# EAGLE design main (EAGLE 9.0.1)
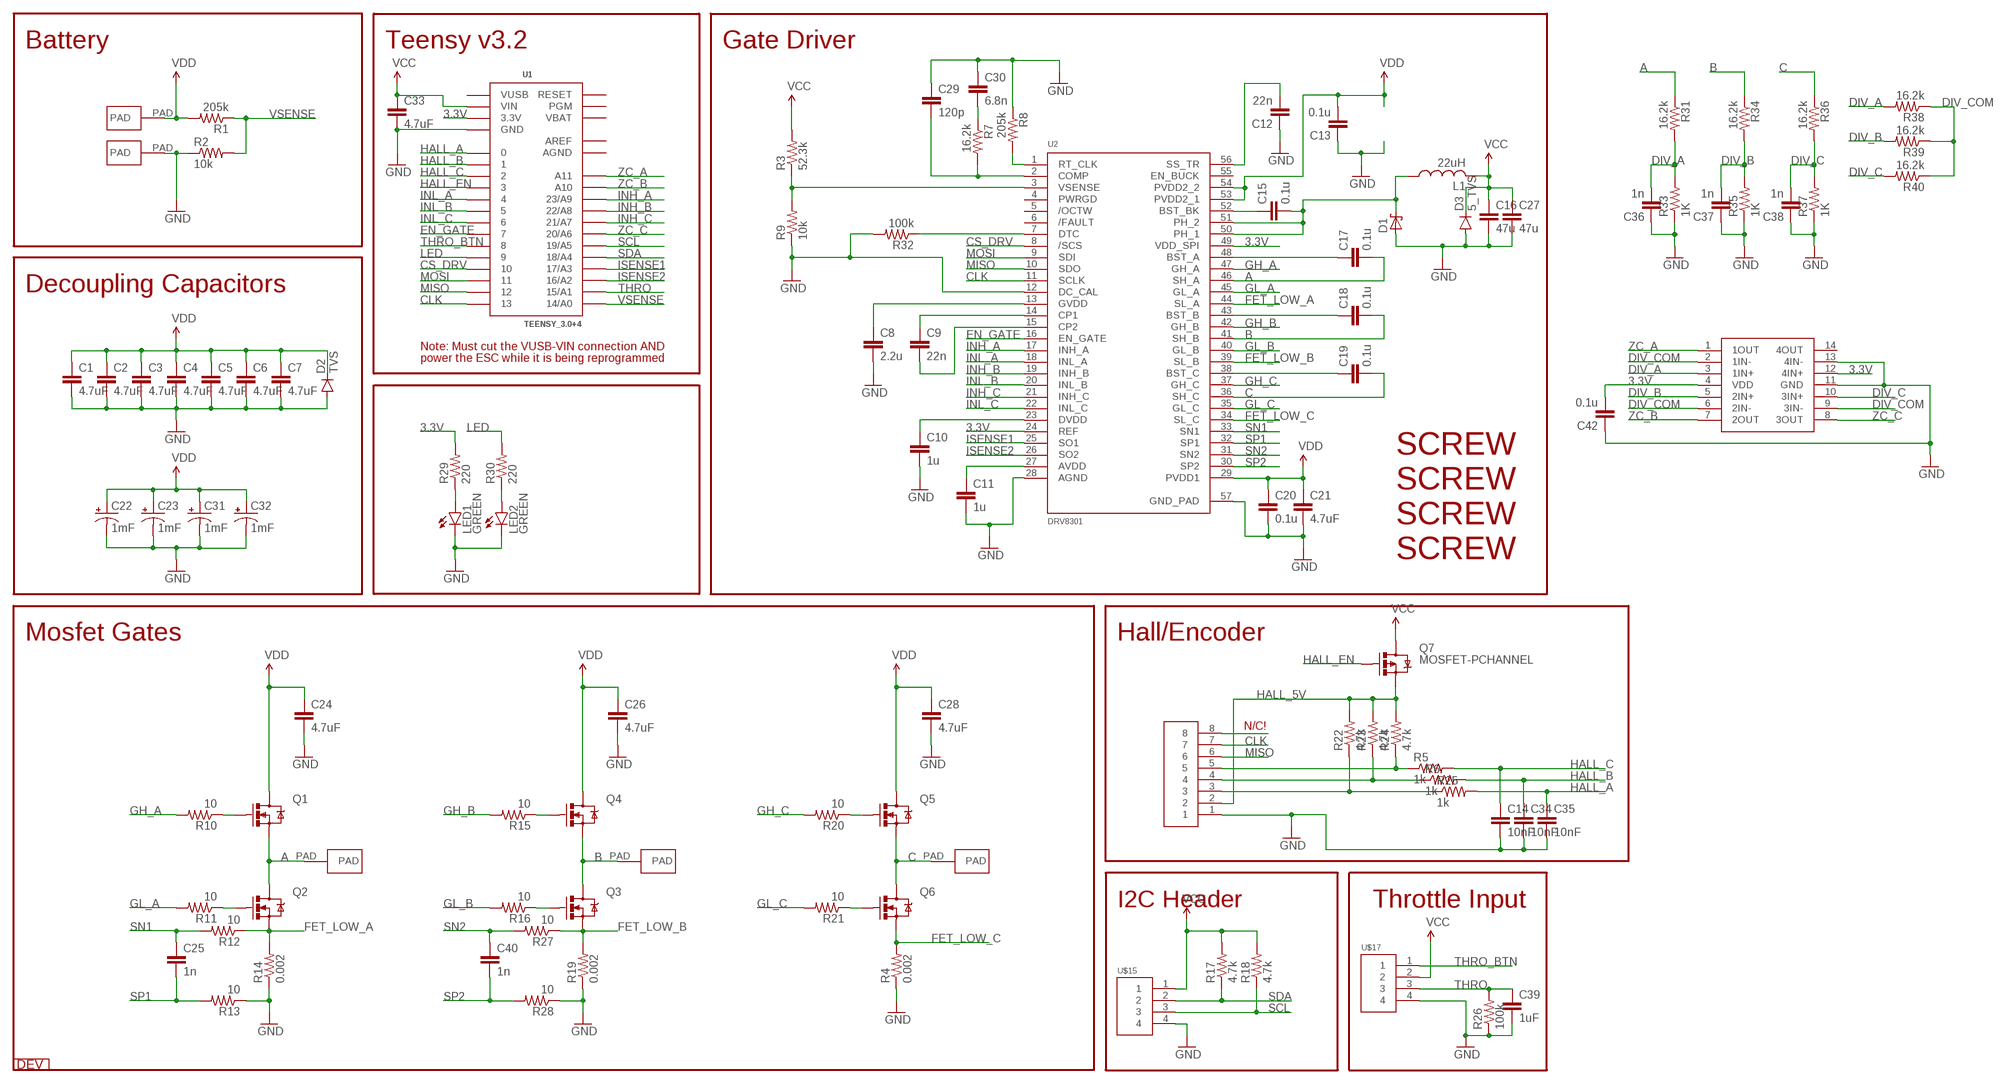
[diagram p0: schematic, sheet 1]

## Parts
C1  4.7uF  CAP1206  [1206]
C2  4.7uF  CAP1206  [1206]
C3  4.7uF  CAP1206  [1206]
C4  4.7uF  CAP1206  [1206]
C5  4.7uF  CAP1206  [1206]
C6  4.7uF  CAP1206  [1206]
C7  4.7uF  CAP1206  [1206]
C8  2.2u  CAP0603-CAP  [0603-CAP]
C9  22n  CAP0603-CAP  [0603-CAP]
C10  1u  CAP0603-CAP  [0603-CAP]
C11  1u  CAP0603-CAP  [0603-CAP]
C12  22n  CAP0603-CAP  [0603-CAP]
C13  0.1u  CAP0603-CAP  [0603-CAP]
C14  10nF  CAP0603-CAP  [0603-CAP]
C15  0.1u  CAP0603-CAP  [0603-CAP]
C16  47u  CAP0805  [0805]
C17  0.1u  CAP0603-CAP  [0603-CAP]
C18  0.1u  CAP0603-CAP  [0603-CAP]
C19  0.1u  CAP0603-CAP  [0603-CAP]
C20  0.1u  CAP0603-CAP  [0603-CAP]
C21  4.7uF  CAP1206  [1206]
C22  1mF  CAP_POLPTH4  [CPOL-RADIAL-1000UF-25V]
C23  1mF  CAP_POLPTH4  [CPOL-RADIAL-1000UF-25V]
C24  4.7uF  CAP1206  [1206]
C25  1n  CAP0603-CAP  [0603-CAP]
C26  4.7uF  CAP1206  [1206]
C27  47u  CAP0805  [0805]
C28  4.7uF  CAP1206  [1206]
C29  120p  CAP0603-CAP  [0603-CAP]
C30  6.8n  CAP0603-CAP  [0603-CAP]
C31  1mF  CAP_POLPTH4  [CPOL-RADIAL-1000UF-25V]
C32  1mF  CAP_POLPTH4  [CPOL-RADIAL-1000UF-25V]
C33  4.7uF  CAP1206  [1206]
C34  10nF  CAP0603-CAP  [0603-CAP]
C35  10nF  CAP0603-CAP  [0603-CAP]
C36  1n  CAP0603-CAP  [0603-CAP]
C37  1n  CAP0603-CAP  [0603-CAP]
C38  1n  CAP0603-CAP  [0603-CAP]
C39  1uF  CAP0603-CAP  [0603-CAP]
C40  1n  CAP0603-CAP  [0603-CAP]
C42  0.1u  CAP0603-CAP  [0603-CAP]
D1  SCHOTTKY_SMA  [SMA]
D2  TVS  DIODEES3J  [SMC]
D3  5_TVS  DIODESOT23  [SOT23-3]
L1  22uH  L-USL5650M  [L5650M]
LED1  GREEN  LED1206  [LED-1206]
LED2  GREEN  LED1206  [LED-1206]
Q1  MOSFET-NCHANNELDFN5X6  [DFN5X6]
Q2  MOSFET-NCHANNELDFN5X6  [DFN5X6]
Q3  MOSFET-NCHANNELDFN5X6  [DFN5X6]
Q4  MOSFET-NCHANNELDFN5X6  [DFN5X6]
Q5  MOSFET-NCHANNELDFN5X6  [DFN5X6]
Q6  MOSFET-NCHANNELDFN5X6  [DFN5X6]
Q7  MOSFET-PCHANNEL  [SOT23-3]
R1  205k  RESISTOR0603  [0603-RES]
R2  10k  RESISTOR0603  [0603-RES]
R3  52.3k  RESISTOR0603  [0603-RES]
R4  0.002  RESISTOR2512  [R2512]
R5  1k  RESISTOR0603-RES  [0603-RES]
R6  1k  RESISTOR0603-RES  [0603-RES]
R7  16.2k  RESISTOR0603  [0603-RES]
R8  205k  RESISTOR0603  [0603-RES]
R9  10k  RESISTOR0603  [0603-RES]
R10  10  RESISTOR0603  [0603-RES]
R11  10  RESISTOR0603  [0603-RES]
R12  10  RESISTOR0603  [0603-RES]
R13  10  RESISTOR0603  [0603-RES]
R14  0.002  RESISTOR2512  [R2512]
R15  10  RESISTOR0603  [0603-RES]
R16  10  RESISTOR0603  [0603-RES]
R17  4.7k  RESISTOR0603-RES  [0603-RES]
R18  4.7k  RESISTOR0603-RES  [0603-RES]
R19  0.002  RESISTOR2512  [R2512]
R20  10  RESISTOR0603  [0603-RES]
R21  10  RESISTOR0603  [0603-RES]
R22  4.7k  RESISTOR0603  [0603-RES]
R23  4.7k  RESISTOR0603  [0603-RES]
R24  4.7k  RESISTOR0603  [0603-RES]
R25  1k  RESISTOR0603-RES  [0603-RES]
R26  100k  RESISTOR0603-RES  [0603-RES]
R27  10  RESISTOR0603  [0603-RES]
R28  10  RESISTOR0603  [0603-RES]
R29  220  RESISTOR0603  [0603-RES]
R30  220  RESISTOR0603  [0603-RES]
R31  16.2k  RESISTOR0603  [0603-RES]
R32  100k  RESISTOR0603  [0603-RES]
R33  1K  RESISTOR0603  [0603-RES]
R34  16.2k  RESISTOR0603  [0603-RES]
R35  1K  RESISTOR0603  [0603-RES]
R36  16.2k  RESISTOR0603  [0603-RES]
R37  1K  RESISTOR0603  [0603-RES]
R38  16.2k  RESISTOR0603  [0603-RES]
R39  16.2k  RESISTOR0603  [0603-RES]
R40  16.2k  RESISTOR0603  [0603-RES]
U1  TEENSY_3.0+4  [TEENSY_3.0+4]
U2  DRV8301  [DRV8301]
U$2  HEADER8  [8PINVALULOK]
U$12  OPAMP_QUAD  [TSSOP-14]
U$15  HEADER4VALULOK  [4PINVALULOK]
U$16  DEV  [DEV]
U$17  HEADER4VALULOK  [4PINVALULOK]
U$19  SCREW  [M3HOLE]
U$20  SCREW  [M3HOLE]
U$21  SCREW  [M3HOLE]
U$22  SCREW  [M3HOLE]
U$23  PAD  [PAD]
U$24  PAD  [PAD]
U$25  PAD  [PAD]
U$26  PAD  [PAD]
U$27  PAD  [PAD]

## Nets
3.3V: C42.2 R29.2 U1.3.3V U1.3.3V1(3.3V) U2.24(REF) U2.49(VDD_SPI) U$12.4(VDD) U$12.12(4IN+)
A: C17.2 Q1.1(S) Q1.2(S) Q1.3(S) Q2.PAD(D) R31.1 U2.46(SH_A) U$23.PAD
B: C18.2 Q3.PAD(D) Q4.1(S) Q4.2(S) Q4.3(S) R34.1 U2.41(SH_B) U$24.PAD
C: C19.2 Q5.1(S) Q5.2(S) Q5.3(S) Q6.PAD(D) R36.1 U2.36(SH_C) U$25.PAD
CLK: U1.13 U2.11(SCLK) U$2.7
CS_DRV: U1.10 U2.8(/SCS)
DIV_A: C36.2 R31.2 R33.2 R38.2 U$12.3(1IN+)
DIV_B: C37.2 R34.2 R35.2 R39.2 U$12.5(2IN+)
DIV_C: C38.2 R36.2 R37.2 R40.2 U$12.10(3IN+)
DIV_COM: R38.1 R39.1 R40.1 U$12.2(1IN-) U$12.6(2IN-) U$12.9(3IN-)
EN_GATE: U1.7 U2.16(EN_GATE)
FET_LOW_A: Q2.1(S) Q2.2(S) Q2.3(S) R12.1 R14.2 U2.44(SL_A)
FET_LOW_B: Q3.1(S) Q3.2(S) Q3.3(S) R19.2 R27.1 U2.39(SL_B)
FET_LOW_C: Q6.1(S) Q6.2(S) Q6.3(S) R4.2 U2.34(SL_C)
GH_A: R10.2 U2.47(GH_A)
GH_B: R15.2 U2.42(GH_B)
GH_C: R20.2 U2.37(GH_C)
GL_A: R11.2 U2.45(GL_A)
GL_A': Q2.4(G) R11.1
GL_B: R16.2 U2.40(GL_B)
GL_B': Q3.4(G) R16.1
GL_C: R21.2 U2.35(GL_C)
GL_C': Q6.4(G) R21.1
GND: C1.2 C2.2 C3.2 C4.2 C5.2 C6.2 C7.2 C8.2 C10.2 C11.2 C12.1 C13.1 C14.2 C16.2 C20.2 C21.2 C22.- C23.- C24.2 C26.2 C27.2 C28.2 C29.1 C30.1 C31.- C32.- C33.2 C34.2 C35.2 C36.1 C37.1 C38.1 C39.2 C42.1 D1.A D2.A D3.1(A) LED1.C LED2.C R2.1 R4.1 R8.1 R9.1 R13.1 R14.1 R19.1 R26.1 R28.1 R32.2 R33.1 R35.1 R37.1 U1.GND U1.GND1(GND) U2.12(DC_CAL) U2.28(AGND) U2.57(GND_PAD) U$2.1 U$12.11(GND) U$12.13(4IN-) U$15.4 U$17.4 U$27.PAD
HALL_5V: Q7.2(S) R22.2 R23.2 R24.2 U$2.2
HALL_A: C35.1 R25.2 U1.0
HALL_B: C34.1 R6.2 U1.1
HALL_C: C14.1 R5.2 U1.2
HALL_EN: Q7.1(G) U1.3
INH_A: U1.23/A9 U2.17(INH_A)
INH_B: U1.22/A8 U2.19(INH_B)
INH_C: U1.21/A7 U2.21(INH_C)
INL_A: U1.4 U2.18(INL_A)
INL_B: U1.5 U2.20(INL_B)
INL_C: U1.6 U2.22(INL_C)
ISENSE1: U1.17/A3 U2.25(SO1)
ISENSE2: U1.16/A2 U2.26(SO2)
LED: R30.2 U1.9
MISO: U1.12 U2.10(SDO) U$2.6
MOSI: U1.11 U2.9(SDI)
N$1: Q4.4(G) R15.1
N$2: R3.1 R9.2 U2.3(VSENSE)
N$3: C29.2 R7.2 U2.2(COMP)
N$4: C10.1 U2.23(DVDD)
N$5: Q5.4(G) R20.1
N$6: C12.2 U2.56(SS_TR)
N$7: C30.2 R7.1
N$8: C15.1 U2.52(BST_BK)
N$9: Q1.4(G) R10.1
N$10: R8.2 U2.1(RT_CLK)
N$11: LED1.A R29.1
N$12: R32.1 U2.7(DTC)
N$13: R5.1 R24.1 U$2.5
N$14: R6.1 R23.1 U$2.4
N$15: R22.1 R25.1 U$2.3
N$16: LED2.A R30.1
N$17: U$2.8
N$28: C19.1 U2.38(BST_C)
N$30: C9.1 U2.14(CP1)
N$31: C11.1 U2.27(AVDD)
N$32: C9.2 U2.15(CP2)
N$33: C8.1 U2.13(GVDD)
N$34: C18.1 U2.43(BST_B)
N$44: C17.1 U2.48(BST_A)
N$47: C15.2 D1.C L1.1 U2.50(PH_1) U2.51(PH_2)
SCL: R18.1 U1.19/A5 U$15.3
SDA: R17.1 U1.18/A4 U$15.2
SN1: C25.1 R12.2 U2.33(SN1)
SN2: C40.1 R27.2 U2.31(SN2)
SP1: C25.2 R13.2 U2.32(SP1)
SP2: C40.2 R28.2 U2.30(SP2)
THRO: C39.1 R26.2 U1.15/A1 U$17.3
THRO_BTN: U1.8 U$17.1
VCC: C16.1 C27.1 C33.1 D3.3(C) L1.2 Q7.3(D) R3.2 R17.2 R18.2 U1.VIN U$15.1 U$17.2
VDD: C1.1 C2.1 C3.1 C4.1 C5.1 C6.1 C7.1 C13.2 C20.1 C21.1 C22.+ C23.+ C24.1 C26.1 C28.1 C31.+ C32.+ D2.C Q1.PAD(D) Q4.PAD(D) Q5.PAD(D) R1.2 U2.29(PVDD1) U2.53(PVDD2_1) U2.54(PVDD2_2) U$26.PAD
VSENSE: R1.1 R2.2 U1.14/A0
ZC_A: U1.A11 U$12.1(1OUT)
ZC_B: U1.A10 U$12.7(2OUT)
ZC_C: U1.20/A6 U$12.8(3OUT)
Unconnected: U1.PGM U1.RESET U2.4(PWRGD) U2.5(/OCTW) U2.6(/FAULT) U2.55(EN_BUCK) U$12.14(4OUT)

## Notes on the sheet
- Battery | Teensy v3.2 | Gate Driver
- Decoupling Capacitors
- Note: Must cut the VUSB-VIN connection AND
- power the ESC while it is being reprogrammed
- Mosfet Gates | Hall/Encoder
- N/C!
- I2C Header | Throttle Input

## Power pins joined to a net without a drawn wire
AGND: U1.AGND
AREF: U1.AREF
VBAT: U1.VBAT
VUSB: U1.VUSB

## Library data of the parts
C1-C13 C15-C21 C24-C30 C33 C36-C38 C40 C42 = SparkFun-Capacitors:CAP: Capacitor Standard 0603 ceramic capacitor, and 0.1" leaded capacitor.
C14 C34 C35 C39 = SparkFun-Passives:CAP: Capacitor Standard 0603 ceramic capacitor, and 0.1" leaded capacitor.
C22 C23 C31 C32 = SparkFun-Capacitors:CAP_POL: Capacitor Polarized These are standard SMD and PTH capacitors. Normally 10uF, 47uF, and 100uF in electrolytic and tantalum varieties. Always verify the external diameter of the through hole cap, it varies with capacity, voltage, and manufacturer. The EIA devices should be standard.
D1 = sc_usercreated:SCHOTTKY_SMA
D2 = SparkFun-DiscreteSemi:DIODE: Diode These are standard reverse protection diodes and small signal diodes. SMA package can handle up to about 1A. SOD-323 can handle about 200mA. What the SOD-323 package when ordering, there are some mfgs out there that are 5-pin packages.; PROD_ID: DIO-12441; VALUE: 3A/600V
D3 = SparkFun-DiscreteSemi:DIODE: Diode These are standard reverse protection diodes and small signal diodes. SMA package can handle up to about 1A. SOD-323 can handle about 200mA. What the SOD-323 package when ordering, there are some mfgs out there that are 5-pin packages.
L1 = rcl:L-US: INDUCTOR, American symbol
LED1 LED2 = SparkFun-LED:LED: LEDs Standard schematic elements and footprints for 5mm, 3mm, 1206, and 0603 sized LEDs. 5mm - Spark Fun Electronics SKU : COM-00529 (and others)
Q1-Q6 = 2018:MOSFET-NCHANNEL: Generic NMOS footprint
Q7 = SparkFun-DiscreteSemi:MOSFET-PCHANNEL: Generic PMOSFET IRLML2244 - TRANS-11153 (SOT-23 -20V -4.3A) (1.Gate 2.Source 3.Drain) FQP27P06 - COM-10349 <http://www.sparkfun.com/products/10349> (TO-220 -60V -27A) (1.Gate 2.Source 3.Drain); PROD_ID: TRANS-08285
R1-R4 R7-R16 R19-R24 R27-R40 = SparkFun-Resistors:RESISTOR: Resistor Basic schematic elements and footprints for 0603, 1206, and PTH resistors.
R5 R6 R17 R18 R25 R26 = SparkFun-Passives:RESISTOR: Resistor Basic schematic elements and footprints for 0603, 1206, and PTH resistors.
U1 = Teensy3.0:TEENSY_3.0+4: Teensy 3.0 board, showing all pins that are easily acessible. See 'AllAnalogPins" and 'AllPins' packages for additional pin holes, as needed. The 'Basic' package has fewer pins.
U2 = F-J:DRV8301
U$2 = Custom_old:HEADER8
U$12 = 2018:OPAMP_QUAD
U$15 U$17 = Custom_old:HEADER4
U$16 = F-J:DEV
U$19-U$22 = Custom_old:SCREW
U$23-U$27 = Custom_old:PAD

## Board
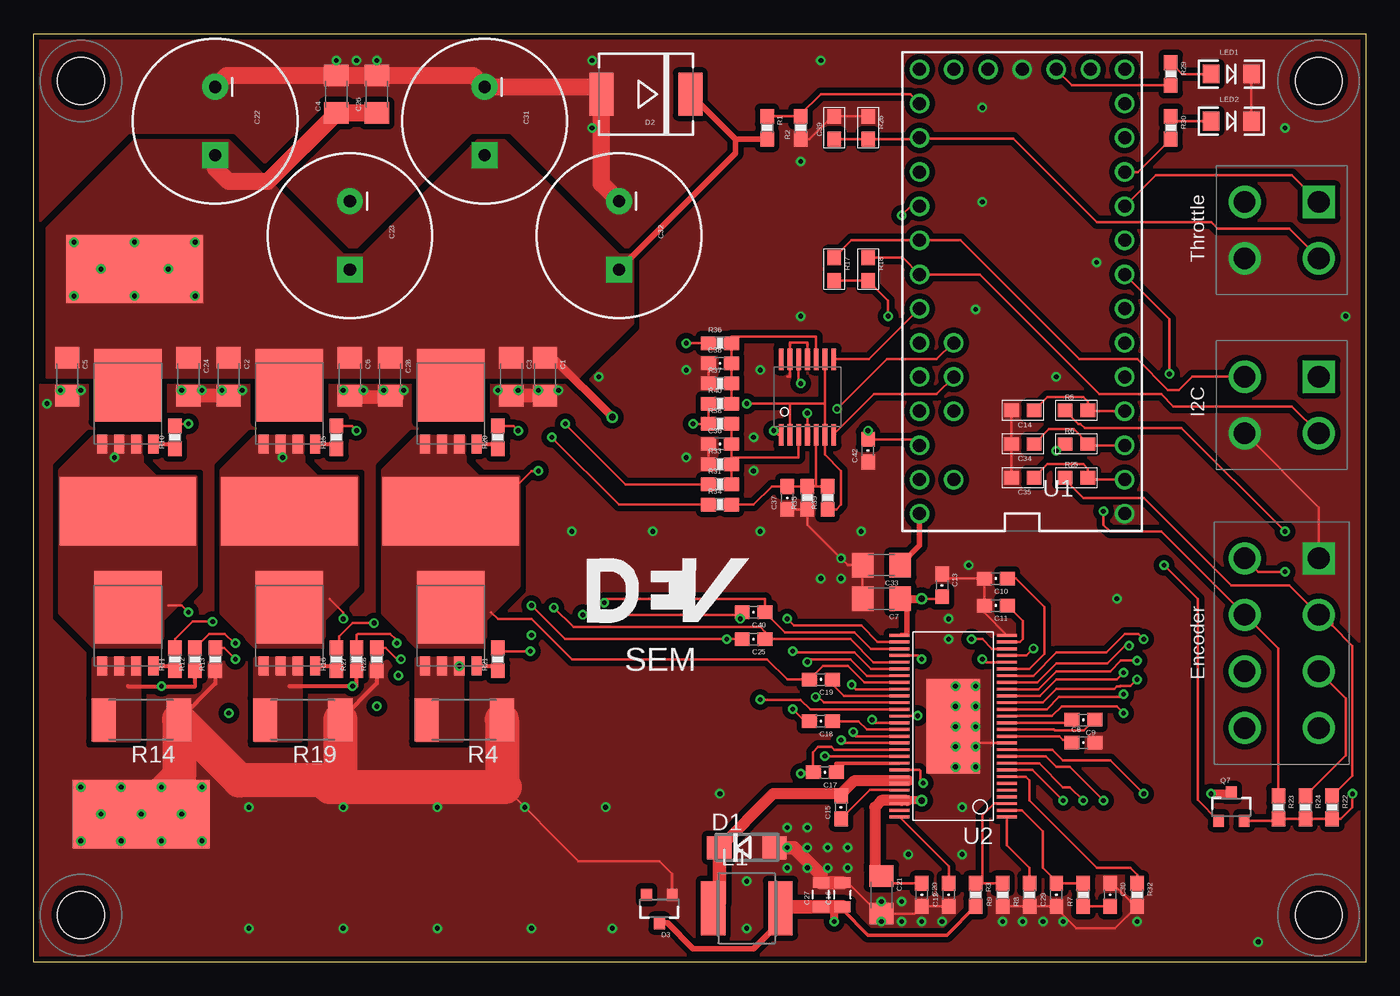
[diagram p1: board, top side]
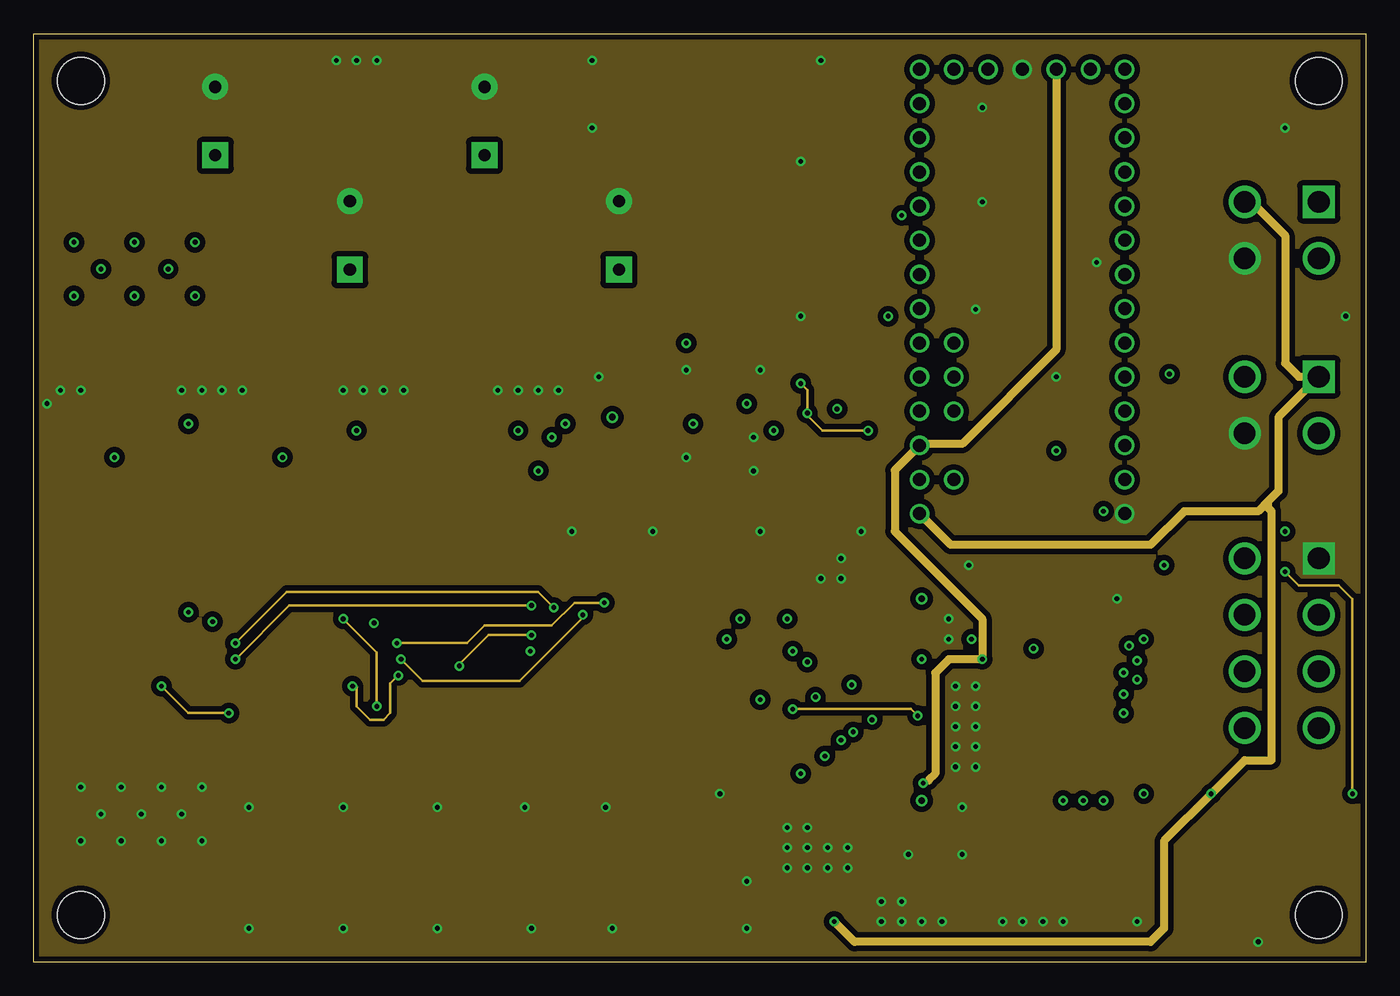
[diagram p2: board, inner layer Route2]
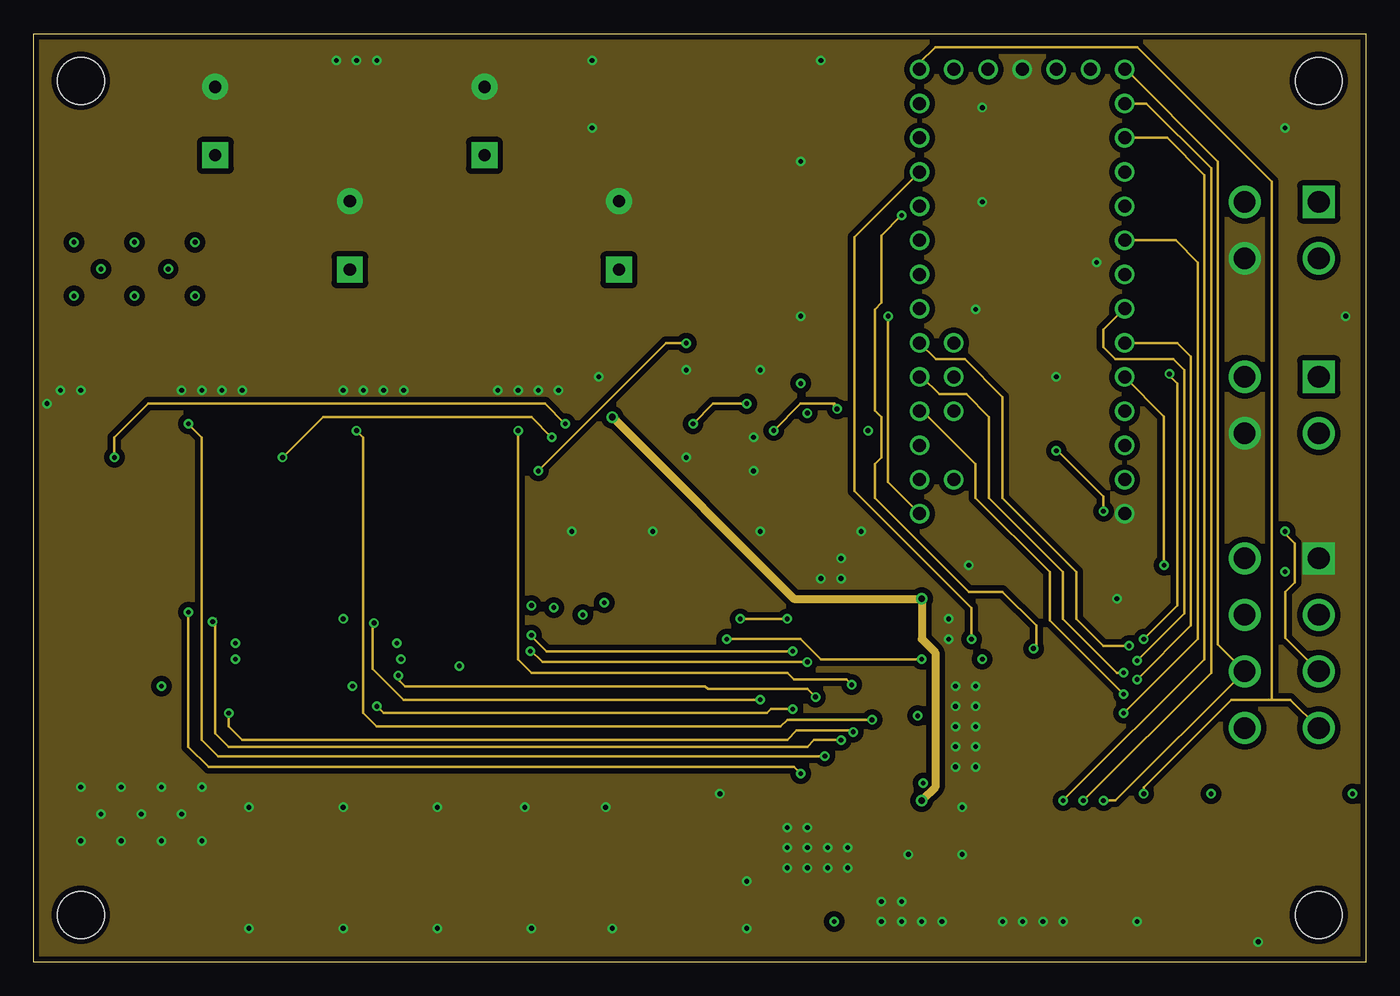
[diagram p3: board, inner layer Route15]
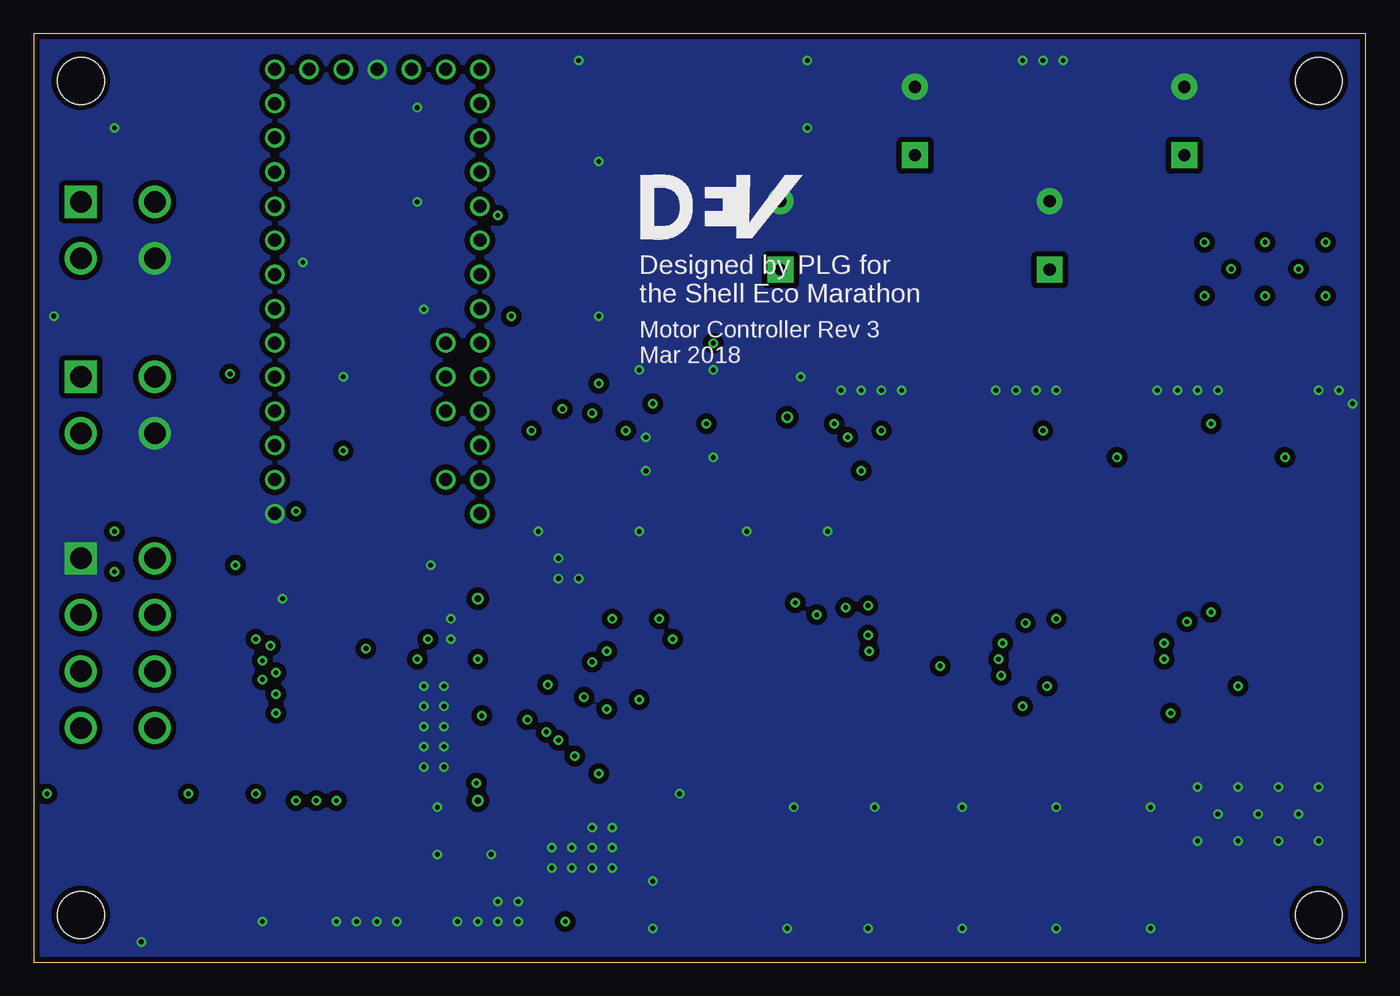
[diagram p4: board, bottom side, seen from below]

Size 99 x 69 mm. Coordinates in mm from the lower left corner, seen from the top.
Outline: 0,0 0,69 99,69 99,0 0,0
Copper layers (1*2+15*16): Top 0.0356mm / dielectric 1.5011mm / Route2 0.0356mm / dielectric 0.1499mm / Route15 0.0356mm / dielectric 0.2007mm / Bottom 0.0356mm
Design rules "patrick *": minimum track width 6mil, minimum drill 13mil, track to track 6mil, track to pad 6mil, pad to pad 6mil, via to via 6mil, smd to smd 6mil, copper to edge 15mil, drill to drill 6mil, minimum pad ring 7mil, minimum via ring 7mil, stop-mask expansion 3mil, vias tented up to drill 30mil, thermal gap 10mil

### Footprints (pad centres in the part's own frame; a part is rotated, then mirrored left to right if it is on the bottom)
1206 = smd 1.6 x 1.8: 1 -1.4,0; 2 1.4,0
0603-CAP = smd 1.1 x 1: 1 -0.85,0; 2 0.85,0
0805 = smd 0.8 x 1.2: 1 -0.9,0; 2 0.9,0
CPOL-RADIAL-1000UF-25V = drill 0.9 pad 1.93 square: + 2.54,0 | drill 0.9 pad 1.93: - -2.54,0
SMA = smd 1.8 x 1.7: A 2.05,0; C -2.05,0
SMC = smd 1.778 x 3.175: A 3.302,0; C -3.302,0
SOT23-3 = smd 0.8 x 0.9: 1 -0.95,-1; 2 0.95,-1; 3 0,1.1
L5650M = smd 1.8 x 4: 1 -2.5,0; 2 2.5,0
LED-1206 = smd 1.2 x 1.4: A -1.5,0; C 1.5,0
DFN5X6 = smd 0.75 x 1.4: 1 -1.905,-3; 2 -0.635,-3; 3 0.635,-3; 4 1.905,-3 | smd 5 x 5.4: PAD 0,1.37
0603-RES = smd 1.1 x 1: 1 -0.85,0; 2 0.85,0
R2512 = smd 1.8 x 3.2: 1 -2.8,0; 2 2.8,0
TEENSY_3.0+4 = drill 0.965: 0 -7.62,13.97; 1 -7.62,11.43; 2 -7.62,8.89; 3 -7.62,6.35; 3.3V 7.62,11.43; 3.3V1 -2.54,-16.51; 4 -7.62,3.81; 5 -7.62,1.27; 6 -7.62,-1.27; 7 -7.62,-3.81; 8 -7.62,-6.35; 9 -7.62,-8.89; 10 -7.62,-11.43; 11 -7.62,-13.97; 12 -7.62,-16.51; 13 7.62,-16.51; 14/A0 7.62,-13.97; 15/A1 7.62,-11.43; 16/A2 7.62,-8.89; 17/A3 7.62,-6.35; 18/A4 7.62,-3.81; 19/A5 7.62,-1.27; 20/A6 7.62,1.27; 21/A7 7.62,3.81; 22/A8 7.62,6.35; 23/A9 7.62,8.89; A10 5.08,6.35; A11 5.08,3.81; AGND 7.62,13.97; AREF 5.08,8.89; GND -7.62,16.51; GND1 0,-16.51; PGM 2.54,-16.51; RESET 5.08,-16.51; VBAT -5.08,-16.51; VIN 7.62,16.51; VUSB 5.08,13.97
DRV8301 = smd 1.5 x 0.21: 1 -4,6.75; 2 -4,6.25; 3 -4,5.75; 4 -4,5.25; 5 -4,4.75; 6 -4,4.25; 7 -4,3.75; 8 -4,3.25; 9 -4,2.75; 10 -4,2.25; 11 -4,1.75; 12 -4,1.25; 13 -4,0.75; 14 -4,0.25; 15 -4,-0.25; 16 -4,-0.75; 17 -4,-1.25; 18 -4,-1.75; 19 -4,-2.25; 20 -4,-2.75; 21 -4,-3.25; 22 -4,-3.75; 23 -4,-4.25; 24 -4,-4.75; 25 -4,-5.25; 26 -4,-5.75; 27 -4,-6.25; 28 -4,-6.75; 29 4,-6.75; 30 4,-6.25; 31 4,-5.75; 32 4,-5.25; 33 4,-4.75; 34 4,-4.25; 35 4,-3.75; 36 4,-3.25; 37 4,-2.75; 38 4,-2.25; 39 4,-1.75; 40 4,-1.25; 41 4,-0.75; 42 4,-0.25; 43 4,0.25; 44 4,0.75; 45 4,1.25; 46 4,1.75; 47 4,2.25; 48 4,2.75; 49 4,3.25; 50 4,3.75; 51 4,4.25; 52 4,4.75; 53 4,5.25; 54 4,5.75; 55 4,6.25; 56 4,6.75 | smd 4 x 7: 57 0,0
8PINVALULOK = drill 1.6 square: 1 0,5.5 | drill 1.6: 2 0,0; 3 4.2,5.5; 4 4.2,0; 5 8.4,5.5; 6 8.4,0; 7 12.6,5.5; 8 12.6,0
TSSOP-14 = smd 1.6 x 0.35: 1 -2.8,1.95; 2 -2.8,1.3; 3 -2.8,0.65; 4 -2.8,0; 5 -2.8,-0.65; 6 -2.8,-1.3; 7 -2.8,-1.95; 8 2.8,-1.95; 9 2.8,-1.3; 10 2.8,-0.65; 11 2.8,0; 12 2.8,0.65; 13 2.8,1.3; 14 2.8,1.95
4PINVALULOK = drill 1.6 square: 1 0,5.5 | drill 1.6: 2 0,0; 3 4.2,5.5; 4 4.2,0
M3HOLE = hole 3.5: 0,0
PAD = smd 10.16 x 5.08: PAD 0,0

### Placement (x,y rotation side)
C1  38,43.5 270 top
C2  14.5,43.5 270 top
C3  35.5,43.5 270 top
C4  22.5,64.5 90 top
C5  2.5,43.5 270 top
C6  23.5,43.5 270 top
C7  63,27 180 top
C8  78,16.3 0 top
C9  78,18 180 top
C10  71.5,28.5 180 top
C11  71.5,26.5 180 top
C12  68,5 90 top
C13  67.5,28 270 top
C14  73.5,41 180 top
C15  60,11.5 90 top
C16  60.1,5 90 top
C17  58.8,14.1 180 top
C18  58.5,17.9 180 top
C19  58.5,21 180 top
C20  66,5 270 top
C21  63,5 270 top
C22  13.5,62.5 270 top
C23  23.5,54 270 top
C24  11.5,43.5 270 top
C25  53.5,24 180 top
C26  25.5,64.5 90 top
C27  58.5,5 90 top
C28  26.5,43.5 270 top
C29  76,5 90 top
C30  80,5 270 top
C31  33.5,62.5 270 top
C32  43.5,54 270 top
C33  63,29.5 180 top
C34  73.5,38.5 180 top
C35  73.5,36 180 top
C36  51,38.5 0 top
C37  56,34.5 90 top
C38  51,44.5 0 top
C39  59.5,62 90 top
C40  53.5,26 180 top
C42  62,38 90 top
D1  53,8.5 0 top
D2  45.5,64.5 180 top
D3  46.5,4 180 top
L1  53,4 0 top
LED1  89,66 0 top
LED2  89,62.5 0 top
Q1  7,41.5 0 top
Q2  7,25 0 top
Q3  19,25 0 top
Q4  19,41.5 0 top
Q5  31,41.5 0 top
Q6  31,25 0 top
Q7  89,11.5 0 top
R1  54.5,62 270 top
R2  57,62 90 top
R3  70,5 270 top
R4  32,18 180 top
R5  77.5,41 0 top
R6  77.5,38.5 0 top
R7  78,5 90 top
R8  74,5 90 top
R9  72,5 90 top
R10  10.5,39 90 top
R11  10.5,22.5 90 top
R12  12,22.5 90 top
R13  13.5,22.5 90 top
R14  8,18 180 top
R15  22.5,39 90 top
R16  22.5,22.5 90 top
R17  59.5,51.5 270 top
R18  62,51.5 270 top
R19  20,18 180 top
R20  34.5,39 90 top
R21  34.5,22.5 90 top
R22  96.5,11.5 270 top
R23  92.5,11.5 270 top
R24  94.5,11.5 270 top
R25  77.5,36 0 top
R26  62,62 270 top
R27  24,22.5 90 top
R28  25.5,22.5 90 top
R29  84.5,66 270 top
R30  84.5,62 270 top
R31  51,35.5 0 top
R32  82,5 270 top
R33  51,37 0 top
R34  51,34 0 top
R35  57.5,34.5 90 top
R36  51,46 0 top
R37  51,43 0 top
R38  51,40 0 top
R39  59,34.5 90 top
R40  51,41.5 0 top
U1  73.46,49.83 180 top
U2  68.33,17.53 180 top
U$2  90,30 270 top
U$12  57.5,42 90 top
U$15  90,43.5 270 top
U$16  41.15,25.24 0 top
U$17  90,56.5 270 top
U$19  3.5,3.5 0 top
U$20  95.5,3.5 0 top
U$21  3.5,65.5 0 top
U$22  95.5,65.5 0 top
U$23  7,33.5 0 top
U$24  19,33.5 180 top
U$25  31,33.5 180 top
U$26  7.5,51.5 0 top
U$27  8,11 0 top
U$28  DEV  [DEV]  53.85,53.74 0 bottom

### Tracks (layer width: path | path; a pad name or v marks a point on that pad's centre or on a via)
3.3V  (via drill 0.35)
  Top 0.203: R29.2 77.15,65.15 76,66.3 U1.3.3V1 | U1.3.3V 65.39,38.85 C42.2 v62,39.5 | U$12.4 v57.5,40.8 | v57,43 56.85,43.15 U$12.12 | v66.1,13.3 65.9,13.5 65.9,14.2 65.82,14.28 U2.49 | U2.24 70.82,22.28 70.7,22.4 70.6,22.4 v70.5,22.5
  Route2 0.203: v62,39.5 58.6,39.5 57.5,40.6 v57.5,40.8 57.5,42.5 v57,43 | 66.5,13.5 66.3,13.3 v66.1,13.3
  Route2 0.61: 66.5,13.5 67,14 67,21.5 68,22.5 v70.5,22.5 70.5,25.5 64,32 64,36.56 U1.3.3V 65.94,38.5 69,38.5 76,45.5 U1.3.3V1
A  (via drill 0.35)
  Top 0.203: U2.46 59.52,15.78 59.3,16 58.3,16 57.9,15.6 57.9,14.15 C17.2 57.1,14.1 v57,14 | v11.5,26 11,26.5 10,26.5 | R31.1 44,35.5 v39.5,40
  Route15 0.203: v57,14 56.5,14.5 13,14.5 11.5,16 v11.5,26 | v39.5,40 38,41.5 8.5,41.5 6,39 v6,37.5
  pour Top (isolate 0.406, no thermals): 4.5,39 2,36.5 2,31 2,26 4.5,23.5 9.5,23.5 9.5,25.5 12,28 12,36 9,36 8,37 8,39
B  (via drill 0.35)
  Top 0.203: U2.41 65.58,18.28 65.6,18.3 v65.7,18.3 | v56.4,18.8 57.3,17.9 C18.2 | v23,25.5 23,26 22,27 | R34.1 43.5,34 v38.5,39
  Route2 0.203: v65.7,18.3 65.2,18.8 v56.4,18.8 | v25.5,19 25.5,23 v23,25.5
  Route15 0.203: v56.4,18.8 54.8,18.8 54.5,18.5 26,18.5 v25.5,19 | v38.5,39 37,40.5 21.5,40.5 v18.5,37.5
  pour Top (isolate 0.406, no thermals): 16.5,39 14,36.5 14,31 14,26 16.5,23.5 21.5,23.5 21.5,25.5 24,28 24,36 21,36 20,37 20,39
C  (via drill 0.35)
  Top 0.203: U2.36 61.72,20.78 60.5,22 58.65,22 C19.2 56,21 54.5,22.5 40,22.5 37,25.5 34.5,25.5 34,26 | R36.1 v48.5,46 | v37.5,36.5 37,36.5 36,35.5
  Route15 0.203: v48.5,46 47,46 v37.5,36.5
  pour Top (isolate 0.406, no thermals): 28.5,39 26,36.5 26,31 26,26 28.5,23.5 33.5,23.5 33.5,25.5 36,28 36,36 33,36 32,37 32,39
CLK  (via drill 0.35)
  Top 0.203: U2.11 75.72,15.78 76.5,15 80,15 v82.5,12.5
  Route15 0.203: v82.5,12.5 82.5,13 89,19.5 92,19.5 | 92,19.5 93.4,19.5 U$2.7 | U1.13 65.84,66.84 67,68 82,68 92,58 92,19.5
CS_DRV  (via drill 0.35)
  Top 0.203: U2.8 74.22,14.28 v76.5,12
  Route15 0.203: v76.5,12 87,22.5 87,58.5 84.24,61.26 U1.10
DIV_A
  Top 0.203: R38.2 C36.2 51.85,37.5 | 51.85,37.5 R33.2 R31.2 | U$12.3 56.85,37.5 51.85,37.5
DIV_B
  Top 0.203: R34.2 53.5,34 54.85,35.35 C37.2 R35.2 58,35.35 | 58,35.35 R39.2 | U$12.5 58.15,35.5 58,35.35
DIV_C
  Top 0.203: R40.2 R37.2 C38.2 R36.2 51.85,46.5 58.15,46.5 U$12.10
DIV_COM  (via drill 0.35)
  Top 0.203: R40.1 R38.1 v49,40 | R39.1 59.65,33.65 60,34 60,36.5 58.8,37.7 U$12.6 58.8,41.5 | 56,41.5 v53,41.5 | 58.5,41.5 56,41.5 | 58.5,41.5 58.8,41.5 | U$12.2 56.2,41.5 56,41.5 | U$12.9 58.8,41.5 | 58.8,41.5 58.5,41.5
  Route15 0.203: v49,40 50.5,41.5 v53,41.5
EN_GATE  (via drill 0.35)
  Top 0.203: U2.16 75.68,18.28 76.4,19 80.5,19 v81,18.5
  Route15 0.203: v81,18.5 86.5,24 86.5,52 84.86,53.64 U1.7
FET_LOW_A  (via drill 0.35)
  Top 0.203: U2.44 61.12,16.78 60.9,17 v60.9,17.1
  Top 0.254: 12,20.5 12,20.8
  Top 0.305: 12,20.8 R12.1 | 7,20.5 v9.5,20.5 12,20.5
  Route2 0.203: v14.5,18.5 11.5,18.5 v9.5,20.5
  Route15 0.203: v60.9,17.1 60.8,17.2 56.7,17.2 56,16.5 15.5,16.5 14.5,17.5 v14.5,18.5
  pour Top (isolate 0.406, no thermals): 4.5,22.5 4.5,16.5 7.8,16.5 7.8,22.5
FET_LOW_B  (via drill 0.35)
  Top 0.203: U2.39 58.72,19.28 58.3,19.7 v58.1,19.7
  Top 0.305: R27.1 24,20.5 v23.7,20.5 19,20.5
  Route2 0.203: v27.1,21.3 26.5,20.7 26.5,18.5 26,18 25,18 24,19 24,20.5 v23.7,20.5
  Route15 0.203: v58.1,19.7 57.5,20.3 50.1,20.3 49.9,20.5 27.6,20.5 27.2,20.9 27.2,21.2 v27.1,21.3
  pour Top (isolate 0.406, no thermals): 16.5,22.5 16.5,16.5 19.8,16.5 19.8,22.5
FET_LOW_C  (via drill 0.35)
  Top 0.203: U2.34 62.22,21.78 61,23 56.5,23 v56.4,23.1
  Route2 0.203: v37,24.3 33.8,24.3 31.5,22 Q6.3
  Route15 0.203: v56.4,23.1 38.1,23.1 37,24.2 v37,24.3
  other vias: 31.64,22
  pour Top (isolate 0.406, no thermals): 28.5,22.5 28.5,16.5 31.8,16.5 31.8,22.5
GH_A  (via drill 0.35)
  Top 0.203: v11.5,40 10.65,40 R10.2 | U2.47 58.82,15.28 v58.8,15.3
  Route15 0.203: v11.5,40 12.5,39 12.5,16.5 13.7,15.3 v58.8,15.3
GH_B  (via drill 0.35)
  Top 0.203: U2.42 62.52,17.78 v62.3,18 | v24,39.5 23.65,39.85 R15.2
  Route15 0.203: v62.3,18 56,18 55.5,17.5 25.5,17.5 24.5,18.5 24.5,39 v24,39.5
GH_C  (via drill 0.35)
  Top 0.203: U2.37 61.12,20.28 v60.8,20.6 | v36,39.5 35.65,39.85 R20.2
  Route15 0.203: v60.8,20.6 60.4,21 56.5,21 56,21.5 37,21.5 36,22.5 v36,39.5
GL_A  (via drill 0.35)
  Top 0.203: U2.45 60.12,16.28 60,16.4 v60,16.5 | v13.3,25.3 11.8,25.3 10.5,24 R11.2
  Route15 0.203: v60,16.5 57.99,16.5 57.5,16 14.5,16 13.5,17 13.5,25.5 v13.3,25.3
GL_A'
  Top 0.305: Q2.4 10.5,22 R11.1
GL_B  (via drill 0.35)
  Top 0.203: U2.40 57.72,18.78 57,19.5 v54,19.5 | v25.3,25.2 23.7,25.2 22.7,24.2 22.7,23.55 R16.2
  Route15 0.203: v54,19.5 27.5,19.5 25.2,21.8 25.2,25.1 v25.3,25.2
GL_B'
  Top 0.305: Q3.4 22.5,22 R16.1
GL_C  (via drill 0.35)
  Top 0.203: U2.35 61.92,21.28 60.7,22.5 57.6,22.5 57.4,22.3 v57.5,22.3 | v36.9,23.1 34.75,23.1 R21.2
  Route15 0.203: v57.5,22.3 37.8,22.3 36.9,23.2 v36.9,23.1
GL_C'
  Top 0.305: Q6.4 34.5,22 R21.1
GND  (via drill 0.35)
  Top 0.203: C38.1 R37.1 | R33.1 C36.1 | C37.1 R35.1 | R35.1 57.5,33.6 | R35.1 57.5,32.5 v60,30 60.5,29.5 C33.2 C7.2 | R9.1 R8.1 C29.1 76,4 77.5,2.5 80.35,2.5 R32.2 81.65,4.5 81.5,4.5 80.15,5.85 C30.1 | U2.57 69.56,16.3 71.3,16.3 71.32,16.28 U2.12 | 34.8,13.2 40.5,7.5 46.5,7.5 47.45,6.55 D3.1 | C16.2 60.5,5.9 62.8,3.6 C21.2 65.45,3.6 C20.2 C12.1 68,4 | LED1.C LED2.C | C14.2 C34.2 C35.2 | U$15.4 95.5,33.8 U$2.1 | R26.1 C39.2 59.15,62.5 59,62.5 57.65,61.15 R2.1 | U2.28 70.65,25.96 C11.2 C10.2 67.85,28.5 C13.1 | U$12.11 57.5,46.04 56.2,46.04 U$12.13 56.2,43.5 56,43.5
  Top 0.305: R28.1 25.5,20.7 R19.1 | R13.1 13.5,20.7 R14.1
  Top 1.016: C24.2 C2.2 | C6.2 23.6,42 26.6,42 | 27,42 26.6,42 | 26.6,42 C28.2 | C3.2 C1.2 | C16.2 C27.2 58.5,6.5 56.5,8.5 v56,8.5 D1.A
  Top 1.27: C22.- 14.36,65.9 C4.2 C26.2 32.64,65.9 C31.- 41.66,65.04 D2.A 42.2,57.84 C32.-
  Top 2.54: U$27.PAD 10.8,13.8 R14.1 15.3,13.5 21.5,13.5 | 21.5,13.5 23,13.5 22.8,13.7 R19.1 | R4.1 34.8,13.2 35,13 22,13 21.5,13.5
  other vias: 54,44 53.5,39 53.5,36.5 1,41.5 2,42.5 3.5,42.5 11,42.5 12.5,42.5 14,42.5 15.5,42.5 23,42.5 24.5,42.5 26,42.5 27.5,42.5 34.5,42.5 36,42.5 37.5,42.5 39,42.5 64.5,3 63,3 66,3 67.5,3 72,3 73.5,3 75,3 76.5,3 53,2.5 53,6 56,10 57.5,10 59,8.5 60.5,8.5 60.5,7 59,7 57.5,8.5 56,7 57.5,7 68,25.5 68,24 68.5,20.5 70,20.5 70,19 68.5,19 70,17.5 68.5,17.5 68.5,16 70,16 70,14.5 68.5,14.5 69,11.5 69,8 65,8 64.5,4.5 63,4.5 8,11 3.5,13 3.5,9 5,11 6.5,13 6.5,9 9.5,9 11,11 9.5,13 12.5,13 12.5,9 16,11.5 23,11.5 30,11.5 42.5,11.5 36.5,11.5 51,12.5 43,2.5 37,2.5 30,2.5 23,2.5 16,2.5 40,32 46,32 54,32 61.5,32 69.5,29.5 80.5,27 76,43.5 70,48.5 70.5,56.5 70.5,63.5 41.5,67 58.5,67 41.5,62 57,59.5 57,48 48.5,37.5 48.5,44 42,43.5 22.5,67 24,67 25.5,67 93,62 82,3 58.5,28.5 60,28.5 91,1.5 79,52 97.5,48
  pour Bottom (isolate 0.406, no thermals): 0,69 99,69 99,0 0,0
  pour Top (isolate 0.406, rank 6, no thermals): -0.5,69.5 99.5,69.5 99.5,-0.5 -0.5,-0.5
  pour Route2 (isolate 0.406, no thermals): -1.5,70.5 100,70.5 100,-1 -1.5,-1
  pour Route15 (isolate 0.406, no thermals): -0.5,69.5 99.5,69.5 99.5,-0.5 -0.5,-0.5
HALL_5V  (via drill 0.35)
  Top 0.203: U$2.2 91,29 v93,29 | v98,12.5 98,11.5 97.15,10.65 R22.2 R24.2 R23.2 92.35,10.5 Q7.2
  Route2 0.203: v93,29 94,28 97,28 98,27 v98,12.5
HALL_A
  Top 0.203: U1.0 78.49,35.86 R25.2 78.35,36.65 78,37 75.35,37 C35.1
HALL_B
  Top 0.203: U1.1 78.45,38.4 R6.2 78.35,38.55 77.3,39.6 75.45,39.6 C34.1
HALL_C
  Top 0.203: U1.2 78.41,40.94 R5.2 78.35,41.65 78,42 75.35,42 C14.1
HALL_EN  (via drill 0.35)
  Top 0.203: Q7.1 86.5,12.05 86.5,27 v84,29.5
  Route15 0.203: v84,29.5 84,40.56 U1.3
INH_A  (via drill 0.35)
  Top 0.203: U2.17 75.28,18.78 76.2,19.7 80.7,19.7 80.9,19.9 v81,19.9
  Route15 0.203: v81,19.9 75.5,25.4 75.5,29 70,34.5 70,37 66.06,40.94 U1.23/A9
INH_B  (via drill 0.35)
  Top 0.203: U2.19 74.78,19.78 76,21 80.5,21 v81,21.5
  Route15 0.203: v81,21.5 80.5,21.5 76.5,25.5 76.5,29 71,34.5 71,40.5 69.3,42.2 67.3,42.2 66.02,43.48 U1.22/A8
INH_C  (via drill 0.35)
  Top 0.203: U2.21 74.58,20.78 76,22.2 79.8,22.2 81.1,23.5 v81.4,23.5 | v81.4,23.5 81.7,23.5 v81.4,23.5
  Route15 0.203: v81.4,23.5 79.5,23.5 77.5,25.5 77.5,29 72,34.5 72,42 69.2,44.8 67.06,44.8 U1.21/A7
INL_A  (via drill 0.35)
  Top 0.203: U2.18 74.98,19.28 76,20.3 80.3,20.3 80.5,20.5 80.74,20.5 80.75,20.51 81.51,20.51 v82,21
  Route15 0.203: v82,21 86,25 86,45 84.98,46.02 U1.4
INL_B  (via drill 0.35)
  Top 0.203: U2.20 74.68,20.28 76,21.6 80,21.6 80.8,22.4 v82,22.4
  Route15 0.203: v82,22.4 85.5,25.9 85.5,44 84.7,44.8 80.4,44.8 79.5,45.7 79.5,47 81.06,48.56 U1.5
INL_C  (via drill 0.35)
  Top 0.203: U2.22 74.28,21.28 76,23 79.7,23 81.1,24.4 82.1,24.4 v82.5,24 | v84.4,43.7 84.4,47.78 U1.6
  Route15 0.203: v82.5,24 85,26.5 85,43 84.4,43.6 v84.4,43.7
ISENSE1  (via drill 0.35)
  Top 0.203: U1.17/A3 65.18,56.18 v64.5,55.5 | v74.3,23.3 73.78,22.78 U2.25
  Route15 0.203: v64.5,55.5 63,54 63,49 62.5,48.5 62.5,41 63,40.5 63,37.5 62.5,37 62.5,34.5 69.5,27.5 72,27.5 74.5,25 74.5,23.5 v74.3,23.3
ISENSE2  (via drill 0.35)
  Top 0.203: U2.26 71.22,23.28 70.5,24 v69.69,24
  Route15 0.203: v69.69,24 69.69,26.31 61,35 61,53.88 U1.16/A2
LED
  Top 0.203: U1.9 82.07,58.72 R30.2
MISO  (via drill 0.35)
  Top 0.203: U2.10 75.22,15.28 76,14.5 77,14.5 v79.5,12
  Route15 0.203: v79.5,12 80.4,12 U$2.6 88,23.6 88,59.5 81.16,66.34 U1.12
MOSI  (via drill 0.35)
  Top 0.203: U2.9 74.72,14.78 76.5,13 77,13 v78,12
  Route15 0.203: v78,12 87.5,21.5 87.5,59 82.7,63.8 U1.11
N$1
  Top 0.305: Q4.4 22.15,38.5 R15.1
N$2
  Top 0.203: 70.5,5.85 R3.1 | 70.5,5.85 R9.2 | U2.3 71.38,11.78 70.5,10.9 70.5,5.85
N$3
  Top 0.203: U2.2 73.42,11.28 75,9.7 75,7 76,6 C29.2 R7.2
N$4
  Top 0.203: U2.23 73.98,21.78 75.1,22.9 75.1,26.4 73,28.5 C10.1
N$5
  Top 0.305: Q5.4 34.15,38.5 R20.1
N$6
  Top 0.203: U2.56 68,7.11 C12.2
N$7
  Top 0.203: R7.1 C30.2
N$8
  Top 0.203: C15.1 62.13,12.78 U2.52
N$9
  Top 0.305: Q1.4 10.15,38.5 R10.1
N$10
  Top 0.203: U2.1 72.33,8.67 74,7 R8.2
N$11
  Top 0.203: R29.1 85.35,66 LED1.A
N$12
  Top 0.203: U2.7 73.72,13.78 74,13.5 74,12 79,7 81.5,7 82,6.5 R32.1
N$13  (via drill 0.35)
  Top 0.203: R24.1 97.5,15.35 97.5,19.6 U$2.5 | v93,32 85.3,39.7 78.1,39.7 77.8,40 77.65,40 R5.1
  Route15 0.203: U$2.5 93,24.1 93,27.5 93.7,28.2 93.7,31.1 93,31.8 v93,32
N$14  (via drill 0.35)
  Top 0.203: R23.1 92.5,23.3 U$2.4 83.8,32 80,32 79.5,32.5 v79.5,33.5 | v76,38 76.15,38 R6.1
  Route15 0.203: v79.5,33.5 79.5,34.6 76,38.1 v76,38
N$15
  Top 0.203: R25.1 76.65,35.85 78,34.5 82.5,34.5 89,28 93.3,28 U$2.3 96.2,25.8 96.5,25.5 96.5,25 98,23.5 98,13.85 R22.1
N$16
  Top 0.203: R30.1 84.85,62.5 LED2.A
N$28
  Top 0.203: U2.38 60.22,19.78 59.35,20.65 C19.1
N$30
  Top 0.203: U2.14 75.82,17.28 75.9,17.2 78.05,17.2 C9.1
N$31
  Top 0.203: C11.1 73.5,25.35 73.5,24 73.28,23.78 U2.27
N$32
  Top 0.203: U2.15 76.93,17.78 C9.2
N$33
  Top 0.203: U2.13 76.22,16.78 76.5,16.5 76.95,16.5 C8.1
N$34
  Top 0.203: U2.43 61.92,17.28 61.3,17.9 C18.1
N$44
  Top 0.254: C17.1 59.63,14.78 U2.48
N$47
  Top 0.203: 65,13.5 64.72,13.78 U2.50 U2.51 | C15.2 60,12.5
  Top 0.813: D1.C 54.95,12.5 60,12.5 61,13.5 65,13.5
  Top 1.016: L1.1 50.95,4.45 D1.C
SCL
  Top 0.203: U$15.3 93.5,41.3 84.7,41.3 83.8,42.2 79.2,42.2 70.3,51.1 U1.19/A5 64.59,52.35 R18.1
SDA
  Top 0.203: U$15.2 86.1,43.5 85.1,42.5 84.3,42.5 82,44.8 77.7,44.8 68.86,53.64 U1.18/A4 60.79,53.64 R17.1
SN1  (via drill 0.35)
  Top 0.203: U2.33 62.42,22.28 60.7,24 C25.1 54.35,24.55 54,24.9 52.76,24.9 52.75,24.89 40.11,24.89 v38.65,26.35 | R12.2 13.05,24.4 14.2,24.4 14.9,23.7 v15,23.7
  Route2 0.203: v15,23.7 18.8,27.5 37.5,27.5 v38.65,26.35
SN2  (via drill 0.35)
  Top 0.203: U2.31 62.22,23.28 61,24.5 55.85,24.5 C40.1 54.35,27 42.4,27 v42.4,26.7 | R27.2 24,24.3 24.1,24.4 26.5,24.4 26.9,24 26.9,23.9 27,23.8 v27,23.7
  Route2 0.203: v27,23.7 32.2,23.7 33.5,25 38.5,25 40.2,26.7 v42.4,26.7
SP1  (via drill 0.35)
  Top 0.203: U2.32 65.72,22.78 v66,22.5 | C25.2 v51.5,24 39.5,24 v37,26.5 | R13.2 14.15,23.35 v15,22.5
  Route2 0.203: v15,22.5 19,26.5 v37,26.5
  Route15 0.203: v66,22.5 58.5,22.5 57,24 v51.5,24
SP2  (via drill 0.35)
  Top 0.203: U2.30 62.72,23.78 61.5,25 56.5,25 v56,25.5 | C40.2 52.65,25.65 v52.5,25.5 52.2,25.8 v40.8,25.8 | R28.2 26.15,23.35 27,22.5 v27.3,22.5
  Route2 0.203: v27.3,22.5 28.9,20.9 36.1,20.9 40.9,25.7 v40.8,25.8
  Route15 0.203: v56,25.5 v52.5,25.5
THRO
  Top 0.203: C39.1 R26.2 65.73,61.15 65.79,61.21 | 65.79,61.21 U1.15/A1 | U$17.3 93.3,54.5 88,54.5 87.5,55 79,55 72.79,61.21 65.79,61.21
THRO_BTN
  Top 0.203: U$17.1 93.5,58.5 83.4,58.5 U1.8
VCC  (via drill 0.35)
  Top 0.203: R17.2 R18.2 63.5,49.15 v63.5,48
  Top 0.254: C16.1 60.1,3.9 62,2 67.85,2 R3.2
  Top 0.406: C33.1 65.84,30.94 U1.VIN | D3.3 47.1,2.9 49,1 53.5,1 55.5,3 L1.2
  Top 0.61: Q7.3 88.9,12.5 v87.5,12.5 | v59.5,3 59.5,4.1
  Top 1.016: L1.2 55.6,4.1 C27.1 59.5,4.1 C16.1
  Route2 0.61: U$17.2 90.5,56.5 93,54 93,44.5 94,43.5 U$15.1 92.5,40.5 92.5,35 91.75,34.25 | 91.75,34.25 91,33.5 85.5,33.5 83,31 68.16,31 U1.VIN | 91.75,34.25 91.75,33.75 92,33.5 92,15 90,15 v87.5,12.5 84,9 84,2.5 83,1.5 61,1.5 v59.5,3
  Route15 0.203: v63.5,48 63.5,35.66 U1.VIN
VDD  (via drill 0.35, 0.5)
  Top 0.203: 64.9,24.4 64.45,24.4 U2.29 | U2.54 64.68,11.78 64.9,12 64.61,12 U2.53 64.5,12.11 64.5,12 | C21.1 63.05,5.85 C20.1 | C13.2 67.35,27 v66,27
  Top 0.406: C7.1 64.45,26.95 64.9,26.5 64.9,24.4 | 52.15,61.15 D2.C | 52.15,61.15 R1.2 | C32.+ 52.15,60.11 52.15,61.15
  Top 0.61: C1.1 38.6,44.9 v43,40.5 | v66,27 65.95,26.95 64.45,26.95 | v66,12 64.9,12
  Top 0.813: 64.9,12 64.5,12 63,12 62.5,11.5 62.5,6.9 C21.1
  Top 1.27: C26.1 C4.1 17.4,58 14.5,58 13.5,59 C22.+
  Route15 0.61: v43,40.5 56.5,27 v66,27 66,24 67,23 67,13 v66,12
  other vias: 3,53.5 3,49.5 5,51.5 7.5,49.5 10,51.5 12,49.5 12,53.5 7.5,53.5
  pour Top (isolate 0.406, no thermals): 1,54.5 1,43.5 40.5,43.5 44.5,47.5 44.5,52.5 43.5,52.5 35,61 33,61 24.5,52.5 23,52.5 14.5,61 7.5,61
VSENSE
  Top 0.203: R1.1 R2.2 57,63 58.5,64.5 65.14,64.5 U1.14/A0
ZC_A  (via drill 0.35)
  Top 0.203: U$12.1 55.3,39.2 v55,39.5 | v59.7,41.1 63.4,44.8 67.1,44.8 68.32,46.02 U1.A11
  Route15 0.203: v55,39.5 57,41.5 59.5,41.5 arc90 59.6,41.1 v59.7,41.1
ZC_B
  Top 0.203: U$12.7 62.45,42.2 67.1,42.2 U1.A10
ZC_C
  Top 0.203: U$12.8 62.08,44.8 U1.20/A6

### Text on the board
tPlace: Throttle | I2C | SEM | Encoder
bPlace: Designed by PLG for / the Shell Eco Marathon | Motor Controller Rev 3 / Mar 2018